# Altium project ECE453-MCU.PrjPcb (part 3 of 3)

## Sheet 08_Amp.SchDoc: User IO
size A; Revision: A; SheetNumber: 8; SheetTotal: 8; ECE315_Project_Name: ECE453 Processor Mezzanine
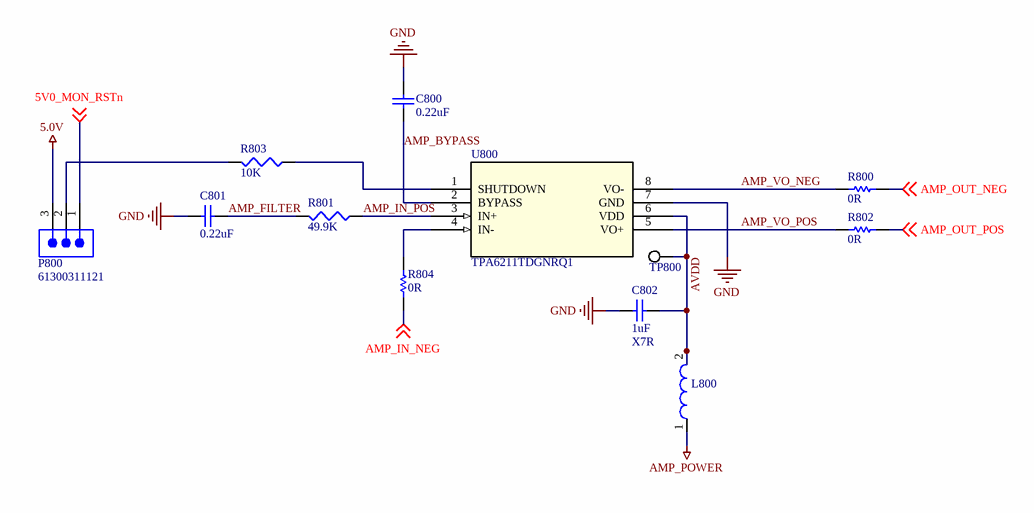
[diagram p7: 08_Amp.SchDoc]

### Parts
C800  0.22uF  [CAPC2012M]
C801  0.22uF  [CAPC2012M]
C802  Dielectric: X7R  [CAPC2012M]  (hidden comment: 1uF)
L800  742792093  [SMD-0805]  (value not drawn)
P800  61300311121  [61300311121]
R800  value 0R  [RESC2013X70X40NL20T20]  (hidden comment: ERJ-6GEY0R00V)
R801  49.9K  [RESC2012M]
R802  value 0R  [RESC2013X70X40NL20T20]  (hidden comment: ERJ-6GEY0R00V)
R803  10K  [RESC2012M]
R804  value 0R  [RESC2013X70X40NL20T20]  (hidden comment: ERJ-6GEY0R00V)
TP800  5019  [KSTN-5019_V]  (value not drawn)
U800  TPA6211TDGNRQ1  [TPA6211TDGNRQ1-W-THERMALPAD]

### Nets
5.0V: P800.3
AMP_POWER: L800.1
GND: C800.2 C801.2 C802.1 U800.7(GND)
5V0_MON_RSTn: P800.1 ; off-sheet 5V0_MON_RSTn
AMP_BYPASS: C800.1 U800.2(BYPASS)
AMP_FILTER: C801.1 R801.2
AMP_IN_NEG: R804.2 ; off-sheet AMP_IN_NEG
AMP_IN_POS: R801.1 U800.3(IN+)
AMP_OUT_NEG: R800.2 ; off-sheet AMP_OUT_NEG
AMP_OUT_POS: R802.2 ; off-sheet AMP_OUT_POS
AMP_VO_NEG: R800.1 U800.8(VO-)
AMP_VO_POS: R802.1 U800.5(VO+)
AVDD: C802.2 L800.2 TP800.1 U800.6(VDD)
NetP800_2: P800.2 R803.2
NetR803_1: R803.1 U800.1(SHUTDOWN)
NetR804_1: R804.1 U800.4(IN-)

### Notes on the sheet
- Title:
- Size:
- A
- Project
- Rev:
- Sheet:
- of
- College of Engineering
- 1415 Engineering Drive
- Madison, WI 53706

### Library data of the parts
C800 C801 = Cap_2: Cap Ceramic 0.22uF 50V X7R 10% SMD 0805 125°C Plastic T/R; Manufacturer: KEMET; Manufacturer Part Number: C0805C224K5RACAUTO7210; Supplier 1: Digi-Key; Supplier Part Number 1: 399-C0805C224K5RACAUTO7210CT-ND; RoHS: Yes; Category: Ceramic Capacitors; Stock 1: 24243; Pricing 1: 1=0.19000, 10=0.12800, 50=0.07680, 100=0.06490, 500=0.04438, 1000=0.03926, 2500=0.03755, 5000=0.03414 (USD); RoHS Compliant: Yes; Value: 0.22uF
C802 = Cap_5: CAP CER 1UF 50V X7R 0805; Manufacturer: Samsung; Manufacturer Part Number: CL21B105KBFNNNE; Tolerance: 10%; Dielectric Material: Ceramic; Value: 1uF; Case Code (Metric): 2012; Min Operating Temperature: -55°C; Mount: Surface Mount; Width: 0.049inch; Voltage Rating (DC): 50V; Voltage Rating: 50V; Height: 1.25mm; Case Code (Imperial): 0805; Supplier: Digi-Key; Supplier Part Number: 1276-1029-6-ND; Capacitance: 1uF; Case/Package: 0805; Construction: Flat; Max Operating Temperature: 125°C; REACH SVHC: No SVHC; Voltage: 50V; Packaging: Tape and Reel; Depth: 1.25mm; Package Quantity: 1; Radiation Hardening: No; Series: CL; Length: 2mm; Thickness: 0.053inch; Termination: SMD/SMT; Number of Pins: 2; RoHS Compliant: Yes
L800 = CMP-0220-00169-1: SMD EMI Suppression Ferrite Bead WE-CBF, Z = 2200 Ohm; Manufacturer: Wurth Electronics; Current Rating: 200mA; Tolerance: 25%; Number of Lines: 1; DC Resistance (DCR): 600mR; Test Frequency: 100MHz; Value: 3.9nH; Shielding: Unshielded; DatasheetVersion: Dec-2005; ComponentLink2URL: http://www.we-online.de/katalog/media/pdf/742792093.pdf; PackageDescription: Chip Inductor, 2-Leads, Body 2.0 x 1.2 mm; Impedance: 2200 Ohm; ComponentLink2Description: Datasheet; ComponentLink1Description: Manufacturer Link; PackageReference: SMD-0805; ComponentLink1URL: http://www.we-online.com; PackageVersion: 2005; Supplier: Newark; Supplier Part Number: 24AC5609; Manufacturer Part Number: 742792093; RoHS: Yes; Category: Ferrite Beads and Chips; Stock: 32000; Pricing: 1=0.145, 4000=0.145 (USD); Mounting Technology: Surface Mount; Case/Package: SMD/SMT; Case Code (Metric): 2012; Case Code (Imperial): 0805; Core Material: Ferrite; Weight: 0.000388oz; Min Operating Temperature: -55°C; Max Operating Temperature: 125°C; Package Quantity: 1; Packaging: Tape and Reel; Max Current Rating: 200mA; Max DC Current: 200mA; Termination: SMD/SMT; Series: WE-CBF; Length: 2mm; Width: 1.2mm; Height: 0.9mm; Depth: 1.2mm; RoHS Compliant: Yes; Reach SVHC Compliant: Unknown; Lead Free: Lead Free; ComponentLink3URL: https://datasheet.ciiva.com/1475/742792093-1475025.pdf?src-supplier=Farnell; ComponentLink3Description: https://datasheet.ciiva.com/1475/742792093-1475025.pdf?src-supplier=Farnell; ComponentLink4URL: https://datasheet.ciiva.com/1013/742792093-1013376.pdf?src-supplier=Digi-Key; ComponentLink4Description: https://datasheet.ciiva.com/1013/742792093-1013376.pdf?src-supplier=Digi-Key; ComponentLink5URL: https://datasheet.ciiva.com/4940/742792093-88569-4940476.pdf?src-supplier=Mouser; ComponentLink5Description: https://datasheet.ciiva.com/4940/742792093-88569-4940476.pdf?src-supplier=Mouser; ComponentLink6URL: https://datasheet.ciiva.com/11799/0900766b80bbd134-11799557.pdf?src-supplier=Rs; ComponentLink6Description: https://datasheet.ciiva.com/11799/0900766b80bbd134-11799557.pdf?src-supplier=Rs; ComponentLink7URL: https://datasheet.ciiva.com/14122/742792093-eng-tds-14122810.pdf?src-supplier=Distrelec; ComponentLink7Description: https://datasheet.ciiva.com/14122/742792093-eng-tds-14122810.pdf?src-supplier=Distrelec
P800 = CMP-1502-01062-2: NexarPartId: 32855521; Pitch: 2.54mm; Gender: Male; Contact Resistance: 20mΩ; Number of Positions: 3; Voltage Rating: 250V; Current Rating: 3A; Connector Type: Male Pin; Orientation: Vertical; Packaging: Bulk; RoHS: Compliant; Mount: Through Hole; Contact Plating: Gold; Contact Material: Copper; Color: Black; Number of Rows: 1; Termination: Solder; Number of Contacts: 3; Contact Mating Length: 5.9944mm; Lead Free: Lead Free; Max Operating Temperature: 105°C; Lead Pitch: 2.54mm; Number of Pins: 3; Height: 8.94mm; Min Operating Temperature: -40°C; Operating Supply Voltage: 250V; REACH SVHC: Unknown
R800 R802 R804 = CMP-1665-00002-5: Chip Resistor, 0 Ohm, +/- 1%, 0.125 W, -55 to 155 degC, 0805 (2012 Metric), RoHS, Tape and Reel; Manufacturer: Panasonic; Tolerance: 5%; Resistance: 0 Ohm; Power Rating: 125mW; Temperature Coefficient: 600ppm/°C; Voltage Rating: 150V; Current Rating: 2A; REACH SVHC: No SVHC; Min Operating Temperature: -55 degC; Case/Package: 0805; Packaging: Tape and Reel; Package Quantity: 5000; ComponentLink1Description: Manufacturer URL; PackageDescription: 2-Pin Surface Mount Device, Body 2 x 1.25 mm; Mounting Technology: Surface Mount; Max Operating Temperature: 155 degC; PartNumber: ERJ-6GEY0R00V; Width: 1.25 mm; RoHSCompliant: True; Height: 0.6 mm; ComponentLink1URL: http://www.panasonic.com/; ComponentLink2URL: http://industrial.panasonic.com/cdbs/www-data/pdf/RDA0000/AOA0000C84.pdf; Case Code (Imperial): 0805; DatasheetVersion: 03/2015; Length: 2 mm; Case Code (Metric): 2012; ComponentLink2Description: Datasheet; Radiation Hardening: No; Supplier: Newark; Supplier Part Number: 65T8846; Manufacturer Part Number: ERJ-6GEY0R00V; RoHS: Yes; Category: Chip SMD Resistors; Stock: 200593; Pricing: 1=0.008, 25=0.008, 50=0.008, 100=0.008, 250=0.008, 500=0.008, 1000=0.008 (USD); Contact Plating: Tin; Series: ERJ; Termination: SMD/SMT; Resistor Type: Thick Film; Number of Terminations: 2; Technology: THICK FILM; Construction: Rectangular; Max Power Dissipation: 125mW; Voltage Rating (DC): 150V; Features: Automotive AEC-Q200; Depth: 1.25mm; Ratings: AEC-Q200; RoHS Compliant: Yes; Reach SVHC Compliant: No; Military Standard: Not; Lead Free: Lead Free
R801 = Res3_3: Res Thick Film 0805 49.9K Ohm 1% 0.125W ±100ppm/°C Molded SMD Paper T/R; Manufacturer: Stackpole Electronics; Manufacturer Part Number: RMCF0805FT49K9; Power Rating: 125mW; ComponentLink1URL: http://components.arrow.com/part/dataview/43746233S7171820N1174?src-supplier=Arrow+Electronics; ComponentLink1Description: http://components.arrow.com/part/dataview/43746233S7171820N1174?src-supplier=Arrow+Electronics; ComponentLink2URL: https://www.seielect.com/Catalog/SEI-RMCF_RMCP.pdf?src-supplier=Digi-Key; ComponentLink2Description: https://www.seielect.com/Catalog/SEI-RMCF_RMCP.pdf?src-supplier=Digi-Key; ComponentLink3URL: https://www.seielect.com/catalog/SEI-Packaging.pdf?src-supplier=Digi-Key; ComponentLink3Description: https://www.seielect.com/catalog/SEI-Packaging.pdf?src-supplier=Digi-Key; ComponentLink4URL: https://www.seielect.com/catalog/SEI-RMCF_RMCP.pdf?src-supplier=Avnet; ComponentLink4Description: https://www.seielect.com/catalog/SEI-RMCF_RMCP.pdf?src-supplier=Avnet; ComponentLink5URL: http://www.seielect.com/Catalog/SEI-RMC.pdf?src-supplier=Future+Electronics; ComponentLink5Description: http://www.seielect.com/Catalog/SEI-RMC.pdf?src-supplier=Future+Electronics; ComponentLink6URL: https://www.verical.com/server-webapp/html/getDatasheet?partID=362599&src-supplier=Verical; ComponentLink6Description: https://www.verical.com/server-webapp/html/getDatasheet?partID=362599&src-supplier=Verical; Supplier 1: Digi-Key; Supplier Part Number 1: RMCF0805FT49K9CT-ND; RoHS: Yes; Category: Chip SMD Resistors; Stock 1: 593081; Pricing 1: 1=0.10000, 10=0.02400, 100=0.00970, 1000=0.00437, 2500=0.00379 (USD); Mounting Technology: Surface Mount; Case/Package: 0805; Case Code (Metric): 2012; Case Code (Imperial): 0805; Contact Plating: Tin,Matte; Min Operating Temperature: -55°C; Max Operating Temperature: 155°C; Packaging: Tape and Reel; Tolerance: 1%; Package Quantity: 1; Resistor Type: Thick Film; Number of Terminations: 2; Max Power Dissipation: 125mW; Temperature Coefficient: 100ppm/°C; Features: Automotive AEC-Q200; Series: RMCF; Construction: Rectangular; Length: 2mm; Width: 0.049inch; Height: 0.026inch; Depth: 1.25mm; Radiation Hardening: No; Military Standard: Not; Lead Free: Lead Free; RoHS Compliant: Yes; Value: 49.9K
R803 = Res3: Res Thick Film 0805 10K Ohm 1% 0.125W ±100ppm/°C Molded SMD Paper T/R; Manufacturer: Stackpole Electronics; Manufacturer Part Number: RMCF0805FT10K0; Power Rating: 125mW; ComponentLink1URL: https://datasheet.ciiva.com/15193/getdatasheetpartid-362046-15193525.pdf?src-supplier=Verical; ComponentLink1Description: https://datasheet.ciiva.com/15193/getdatasheetpartid-362046-15193525.pdf?src-supplier=Verical; Supplier 1: Digi-Key; Supplier Part Number 1: RMCF0805FT10K0CT-ND; RoHS: Yes; Category: Chip SMD Resistors; Stock 1: 3732463; Pricing 1: 1=0.10000, 10=0.02400, 100=0.00970, 1000=0.00437, 2500=0.00379 (USD); Mounting Technology: Surface Mount; Case/Package: 0805; Case Code (Metric): 2012; Case Code (Imperial): 0805; Contact Plating: Tin,Matte; Min Operating Temperature: -55°C; Max Operating Temperature: 155°C; Tolerance: 1%; Packaging: Tape and Reel; Resistor Type: Thick Film; Number of Terminations: 2; Temperature Coefficient: 100ppm/°C; Max Power Dissipation: 125mW; Features: Automotive AEC-Q200; Series: RMCF; Construction: Rectangular; Length: 2mm; Width: 0.049inch; Height: 0.026inch; Depth: 1.25mm; Radiation Hardening: No; Lead Free: Lead Free; Military Standard: Not; RoHS Compliant: Yes; Value: 10K
TP800 = CMP-1672-00008-1: Test Point, 1 Position SMD, RoHS, Tape and Reel; Mounting Technology: Surface Mount; Pins: 1; Contact Plating: Silver; Packaging: Tape and Reel; Package Quantity: 1000; ComponentLink1URL: http://www.keyelco.com/; ComponentLink1Description: Manufacturer URL; ComponentLink2URL: http://www.keyelco.com/product-pdf.cfm?p=1357; ComponentLink2Description: Datasheet; DatasheetVersion: 03/2014; Mount: Surface Mount; PackageDescription: 1-Pin Surface Mount Device, Body 3.81 x 2.03 mm; RoHSCompliant: True; PackageReference: 5019
U800 = TPA6211TDGNRQ1: No Description Available; Mfr_Name: Texas Instruments; Copyright: Copyright (C) 2023 Ultra Librarian. All rights reserved.; Manufacturer_Part_Number: TPA6211TDGNRQ1; RefDes: RefDes; Type: DEV

## Nets that join several sheets
3.3V: 06_Power (8 pins), 03_Connectors (8 pins), 04-MCU (C402.1 C403.1 MD400.4), 05_Mechanicals (J501.07), 07_Programming_Reset (6 pins)
5.0V: 06_Power (8 pins), 02_USB_Bridge (C202.1 C203.1 U200.15), 05_Mechanicals (J502.30), 08_Amp (P800.3)
5.0V_USB: 06_Power (P2.3), 02_USB_Bridge (L200.2)
AMP_POWER: 06_Power (P1.2), 08_Amp (L800.1)
GND: 06_Power (19 pins), 02_USB_Bridge (13 pins), 03_Connectors (10 pins), 04-MCU (7 pins), 05_Mechanicals (J500.02 J500.30 J501.01), 07_Programming_Reset (P700.2 SW700.3 SW700.4 U700.2), 08_Amp (C800.2 C801.2 C802.1 U800.7)
3V3_MON_RSTn: 06_Power (LED2.2 TP2.1 U2.1), 07_Programming_Reset (P701.3)
5V0_MON_RSTn: 06_Power (LED1.2 TP1.1 U1.1), 05_Mechanicals (J501.29), 08_Amp (P800.1)
AMP_IN_NEG: 03_Connectors (P305.2), 08_Amp (R804.2)
AMP_OUT_NEG: 03_Connectors (P306.1 TP306.1), 08_Amp (R800.2)
AMP_OUT_POS: 03_Connectors (P306.2 TP305.1), 08_Amp (R802.2)
FTDI_RX: 02_USB_Bridge (U200.4), 05_Mechanicals (J502.01)
FTDI_TX: 02_USB_Bridge (U200.20), 05_Mechanicals (J502.11)
I2C_SCL: 03_Connectors (R316.1 R318.2), 05_Mechanicals (J502.25)
I2C_SDA: 03_Connectors (R315.1 R317.2), 05_Mechanicals (J502.23)
LED_PAUSE_2: 03_Connectors (R307.1), 05_Mechanicals (J500.11)
LED_PAUSE_3: 03_Connectors (R306.1), 05_Mechanicals (J500.13)
LED_PAUSE_4: 03_Connectors (R305.1), 05_Mechanicals (J500.15)
LED_PLAYER1_POS: 03_Connectors (P302.2), 05_Mechanicals (J501.24)
LED_PLAYER2_POS: 03_Connectors (P304.2), 05_Mechanicals (J501.28)
LED_WINNER_2: 03_Connectors (R314.1), 05_Mechanicals (J500.21)
LED_WINNER_3: 03_Connectors (R313.1), 05_Mechanicals (J500.19)
LED_WINNER_4: 03_Connectors (R312.1), 05_Mechanicals (J500.17)
LIN_ACT_BACKWARD: 03_Connectors (J300.8), 05_Mechanicals (J500.25)
LIN_ACT_FORWARD: 03_Connectors (J300.7), 05_Mechanicals (J500.23)
P0.4: 04-MCU (R408.1), 05_Mechanicals (J500.06)
P0.5: 04-MCU (R410.1), 05_Mechanicals (J501.03)
P5.0: 04-MCU (R412.1), 05_Mechanicals (J500.10)
P5.1: 04-MCU (R414.1), 05_Mechanicals (J500.08)
P5.2: 04-MCU (R416.1), 05_Mechanicals (J500.12)
P5.3: 04-MCU (R418.1), 05_Mechanicals (J500.14)
P5.4: 04-MCU (R420.1), 05_Mechanicals (J502.10)
P5.5: 04-MCU (R422.1), 05_Mechanicals (J500.16)
P5.6: 04-MCU (R424.1), 05_Mechanicals (J500.24)
P6.2: 04-MCU (R427.1), 05_Mechanicals (J502.04)
P6.3: 04-MCU (R429.1), 05_Mechanicals (J500.28)
P6.4: 04-MCU (R430.1), 05_Mechanicals (J502.12)
P6.5: 04-MCU (R431.1), 05_Mechanicals (J502.02)
P6.6: 04-MCU (R432.1), 05_Mechanicals (J502.06)
P6.7: 04-MCU (R433.1), 05_Mechanicals (J502.08)
P7.1: 04-MCU (R400.2), 05_Mechanicals (J502.14)
P7.2: 04-MCU (R401.2), 05_Mechanicals (J502.16)
P7.7: 04-MCU (R402.2), 05_Mechanicals (J500.26)
P9.0: 04-MCU (R403.2), 05_Mechanicals (J502.26)
P9.1: 04-MCU (R404.2), 05_Mechanicals (J502.24)
P9.2: 04-MCU (R405.2), 05_Mechanicals (J502.18)
P9.3: 04-MCU (R406.2), 05_Mechanicals (J501.17)
P9.4: 04-MCU (R407.2), 05_Mechanicals (J501.27)
P9.5: 04-MCU (R409.2), 05_Mechanicals (J502.22)
P9.6: 04-MCU (R411.2), 05_Mechanicals (J502.20)
P10.0: 04-MCU (R413.2), 05_Mechanicals (J501.25)
P10.1: 04-MCU (R415.2), 05_Mechanicals (J501.23)
P10.2: 04-MCU (R417.2), 05_Mechanicals (J500.22)
P10.3: 04-MCU (R419.2), 05_Mechanicals (J501.13)
P10.4: 04-MCU (R421.2), 05_Mechanicals (J501.15)
P10.5: 04-MCU (R423.2), 05_Mechanicals (J501.21)
P10.6: 04-MCU (R425.2), 05_Mechanicals (J501.19)
P12.6: 04-MCU (R426.2), 05_Mechanicals (J500.20)
P12.7: 04-MCU (R428.2), 05_Mechanicals (J500.18)
PB_PASS_TURN: 03_Connectors (P303.2 R303.1 TP303.1), 05_Mechanicals (J501.16)
PB_PLAY_PAUSE: 03_Connectors (P301.2 R300.1 TP301.1), 05_Mechanicals (J501.14)
RPI_RX: 03_Connectors (J308.1 R309.1 TP300.1), 05_Mechanicals (J500.09)
RPI_TX: 03_Connectors (J308.2 R308.1 TP302.1), 05_Mechanicals (J500.07)
SERVO_IN: 03_Connectors (J300.2), 05_Mechanicals (J500.27)
SWDCLK: 05_Mechanicals (J502.07), 07_Programming_Reset (P700.4)
SWDIO: 05_Mechanicals (J502.05), 07_Programming_Reset (P700.5)
TO_AMP: 03_Connectors (C300.2), 05_Mechanicals (J502.19)
XRES_N: 04-MCU (MD400.42 TP400.1), 05_Mechanicals (J500.04), 07_Programming_Reset (LED700.1 U700.4)